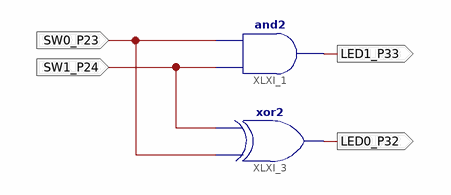
[diagram p0: schematic sheet 1]
// Xilinx ISE schematic HalfAdder.sch (spartan6) as structural Verilog: 2 symbols, 4 ports
module HalfAdder (
  input  SW1_P24,
  input  SW0_P23,
  output LED1_P33,
  output LED0_P32
);

  and XLXI_1 (LED1_P33, SW1_P24, SW0_P23);
  xor XLXI_3 (LED0_P32, SW0_P23, SW1_P24);
endmodule
